# Altium schematic sheet Servo Opto.SchDoc
size A4; SheetNumber: 9; SheetTotal: 9
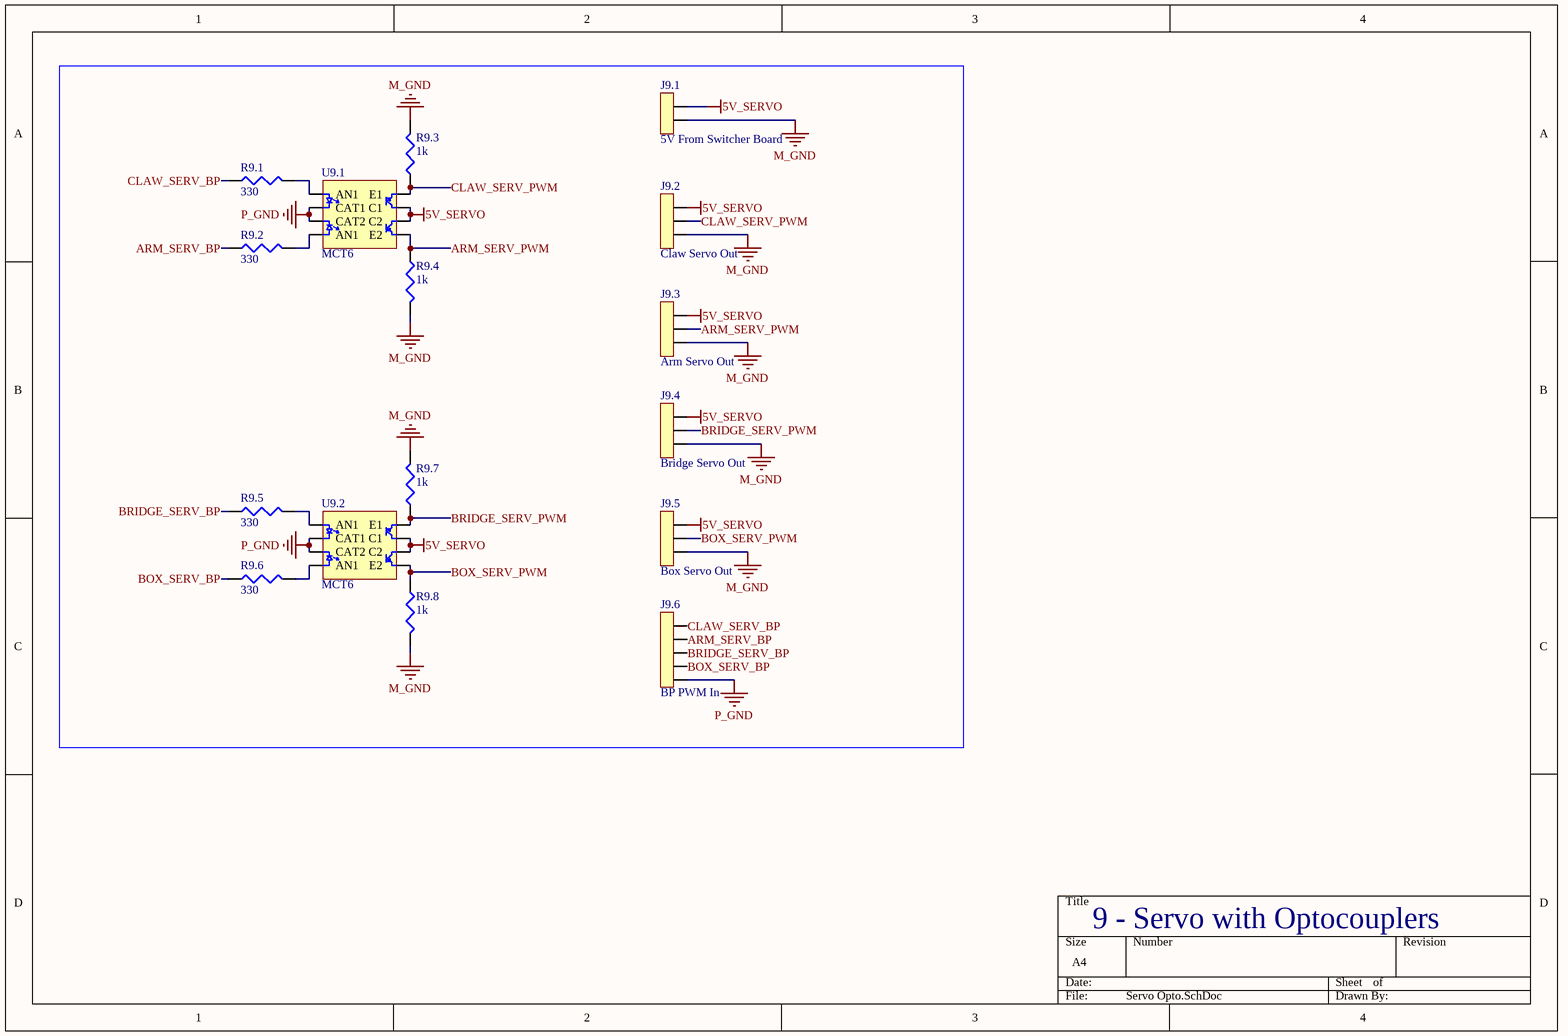
[diagram p0: Servo Opto.SchDoc]

## Parts
J9.1  5V From Switcher Board  [2pos JST]
J9.2  Claw Servo Out  [3pos JST]
J9.3  Arm Servo Out  [3pos JST]
J9.4  Bridge Servo Out  [3pos JST]
J9.5  Box Servo Out  [3pos JST]
J9.6  BP PWM In  [5POS JST]
R9.1  330  [Res_Generic]
R9.2  330  [Res_Generic]
R9.3  1k  [Res_Generic]
R9.4  1k  [Res_Generic]
R9.5  330  [Res_Generic]
R9.6  330  [Res_Generic]
R9.7  1k  [Res_Generic]
R9.8  1k  [Res_Generic]
U9.1  MCT6  [DIP8]
U9.2  MCT6  [DIP8]

## Nets
5V_SERVO: J9.1.2 J9.2.3 J9.3.3 J9.4.3 J9.5.3 U9.1.6(C2) U9.1.7(C1) U9.2.6(C2) U9.2.7(C1)
M_GND: J9.1.1 J9.2.1 J9.3.1 J9.4.1 J9.5.1 R9.3.2 R9.4.2 R9.7.2 R9.8.2
P_GND: J9.6.5 U9.1.2(CAT1) U9.1.3(CAT2) U9.2.2(CAT1) U9.2.3(CAT2)
ARM_SERV_BP: J9.6.3 R9.2.1
ARM_SERV_PWM: J9.3.2 R9.4.1 U9.1.5(E2)
BOX_SERV_BP: J9.6.1 R9.6.1
BOX_SERV_PWM: J9.5.2 R9.8.1 U9.2.5(E2)
BRIDGE_SERV_BP: J9.6.2 R9.5.1
BRIDGE_SERV_PWM: J9.4.2 R9.7.1 U9.2.8(E1)
CLAW_SERV_BP: J9.6.4 R9.1.1
CLAW_SERV_PWM: J9.2.2 R9.3.1 U9.1.8(E1)
NetR9.1_2: R9.1.2 U9.1.1(AN1)
NetR9.2_2: R9.2.2 U9.1.4(AN1)
NetR9.5_2: R9.5.2 U9.2.1(AN1)
NetR9.6_2: R9.6.2 U9.2.4(AN1)

## Notes on the sheet
- 9 - Servo with Optocouplers

## Library data of the parts
J9.1 = 2pos Conn: 2pos Conn JST
J9.2-J9.5 = 3pos Conn
J9.6 = 5pos Conn: 5pos Conn JST
R9.1-R9.8 = Res_Generic
U9.1 U9.2 = MCT6 Optocoupler: Optoisolator 5.3KV 2CH TRANS 8-DIP; Supplier 1: Mouser; Supplier Part Number 1: 512-MCT6